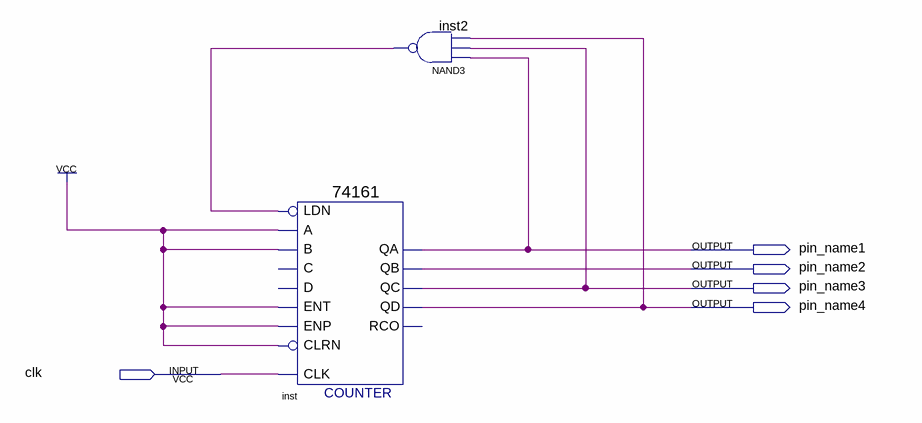
[diagram p0: schematic sheet]
// Quartus schematic THR2023063114.bdf as structural Verilog: 2 symbols, 5 pins
module THR2023063114 (
  input  clk,
  output pin_name1,
  output pin_name2,
  output pin_name3,
  output pin_name4
);

  wire inst2_out;

  \74161  inst (
    .CLRN(1'b1), .CLK(clk), .ENP(1'b1), .LDN(inst2_out), .A(1'b1), .ENT(1'b1), .B(1'b1), .QD(pin_name4),
    .QC(pin_name3), .QB(pin_name2), .QA(pin_name1));  // open: D, C, RCO
  nand inst2 (inst2_out, pin_name1, pin_name3, pin_name4);
endmodule
